# Altium schematic sheet High Side Drivers.SchDoc
size A
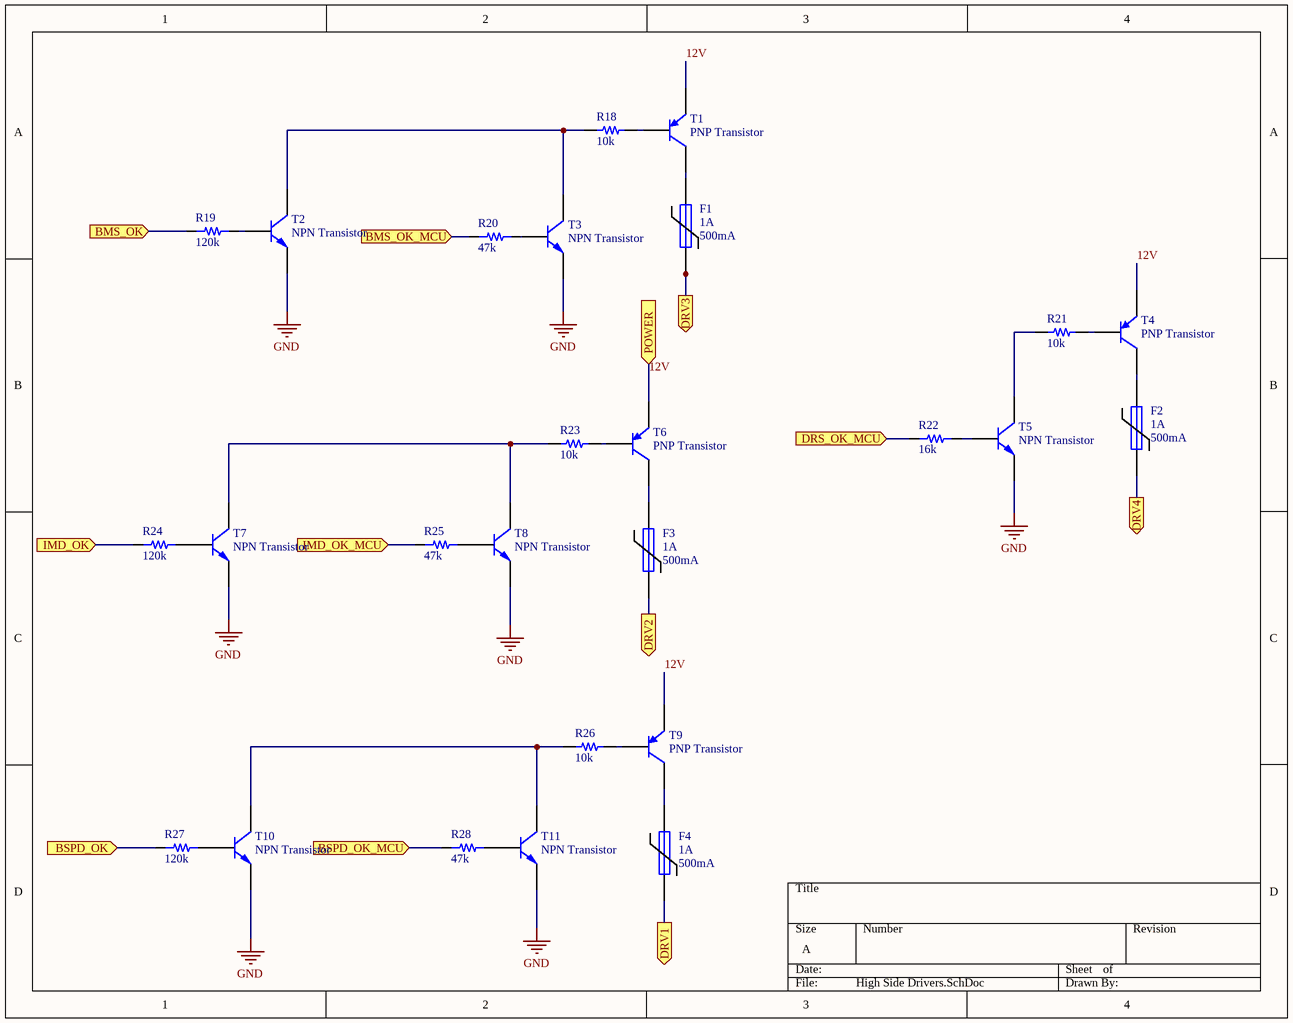
[diagram p0: High Side Drivers.SchDoc]

## Parts
F1  1A  I_hold: 500mA  [PTC Fuse 1206/3216]
F2  1A  I_hold: 500mA  [PTC Fuse 1206/3216]
F3  1A  I_hold: 500mA  [PTC Fuse 1206/3216]
F4  1A  I_hold: 500mA  [PTC Fuse 1206/3216]
R18  value 10k  [RES 0805/2012]  (hidden comment: Resistor 10k 0805 1/4W 5%)
R19  value 120k  [RES 0805/2012]  (hidden comment: Resistor 120k 0805 1/4W 1%)
R20  value 47k  [RES 0805/2012]  (hidden comment: Resistor 47k 0805 1/4W 1%)
R21  value 10k  [RES 0805/2012]  (hidden comment: Resistor 10k 0805 1/4W 5%)
R22  value 16k  [RES 0805/2012]  (hidden comment: Resistor 16k 0805 1/4W 1%)
R23  value 10k  [RES 0805/2012]  (hidden comment: Resistor 10k 0805 1/4W 5%)
R24  value 120k  [RES 0805/2012]  (hidden comment: Resistor 120k 0805 1/4W 1%)
R25  value 47k  [RES 0805/2012]  (hidden comment: Resistor 47k 0805 1/4W 1%)
R26  value 10k  [RES 0805/2012]  (hidden comment: Resistor 10k 0805 1/4W 5%)
R27  value 120k  [RES 0805/2012]  (hidden comment: Resistor 120k 0805 1/4W 1%)
R28  value 47k  [RES 0805/2012]  (hidden comment: Resistor 47k 0805 1/4W 1%)
T1  PNP Transistor  [SOT23-3]
T2  NPN Transistor  [SOT23-3]
T3  NPN Transistor  [SOT23-3]
T4  PNP Transistor  [SOT23-3]
T5  NPN Transistor  [SOT23-3]
T6  PNP Transistor  [SOT23-3]
T7  NPN Transistor  [SOT23-3]
T8  NPN Transistor  [SOT23-3]
T9  PNP Transistor  [SOT23-3]
T10  NPN Transistor  [SOT23-3]
T11  NPN Transistor  [SOT23-3]

## Ports
BMS_OK (in), BMS_OK_MCU (in), BSPD_OK (in), BSPD_OK_MCU (in), DRS_OK_MCU (in), DRV1 (out), DRV2 (out), DRV3 (out), DRV4 (out), IMD_OK (in), IMD_OK_MCU (in), POWER (in)

## Nets
GND: T2.1(E) T3.1(E) T5.1(E) T7.1(E) T8.1(E) T10.1(E) T11.1(E)
12V: T1.2(E) T4.2(E) T6.2(E) T9.2(E) ; port POWER
BMS_OK: R19.1 ; port BMS_OK
BMS_OK_MCU: R20.1 ; port BMS_OK_MCU
BSPD_OK: R27.1 ; port BSPD_OK
BSPD_OK_MCU: R28.1 ; port BSPD_OK_MCU
DRS_OK_MCU: R22.1 ; port DRS_OK_MCU
DRV1: F4.1 ; port DRV1
DRV2: F3.1 ; port DRV2
DRV3: F1.1 ; port DRV3
DRV4: F2.1 ; port DRV4
IMD_OK: R24.1 ; port IMD_OK
IMD_OK_MCU: R25.1 ; port IMD_OK_MCU
NetF1_2: F1.2 T1.3(C)
NetF2_2: F2.2 T4.3(C)
NetF3_2: F3.2 T6.3(C)
NetF4_2: F4.2 T9.3(C)
NetR18_1: R18.1 T2.3(C) T3.3(C)
NetR18_2: R18.2 T1.1(B)
NetR19_2: R19.2 T2.2(B)
NetR20_2: R20.2 T3.2(B)
NetR21_1: R21.1 T5.3(C)
NetR21_2: R21.2 T4.1(B)
NetR22_2: R22.2 T5.2(B)
NetR23_1: R23.1 T7.3(C) T8.3(C)
NetR23_2: R23.2 T6.1(B)
NetR24_2: R24.2 T7.2(B)
NetR25_2: R25.2 T8.2(B)
NetR26_1: R26.1 T10.3(C) T11.3(C)
NetR26_2: R26.2 T9.1(B)
NetR27_2: R27.2 T10.2(B)
NetR28_2: R28.2 T11.2(B)

## Library data of the parts
F1-F4 = 5: Fuse; Manufacturer_id: 1; MfrPartNo: 1206L050/15YR; idFuse: 5; Name: PTC Poly Fuse Resettable; I_max: 100A; V_max: 15V; Pd_Typ: 600mW; Created_By: Angel; Published: 8-Jun-2000; LatestRevisionDate: 17-Jul-2002; LatestRevisionNote: Re-released for DXP Platform.; PackageReference: PIN-W2/E2.8; Publisher: Altium Limited; PackageDescription: Thru-Hole; 2 Leads; Drawer_id: 1; I_trip: 1A; Link: https://www.digikey.com/product-detail/en/littelfuse-inc/1206L050-15YR/F3733CT-ND/2486168; Created_Date: 10/27/2018
R18 R21 R23 R26 = 1825: Manufacturer_id: 1; idResistor: 1825; Name: Res_10k_0805_1/4W_5%; Created_By: Nick Mah; Supplier 1: Digi-Key; Drawer_id: 1; Tolerance: 5%; Power: 1/4W; Package: 0805; ComponentLink1Description: Datasheet; Created_Date: 2018-10-20
R19 R24 R27 = 771: Manufacturer_id: 1; idResistor: 771; Name: Res_120k_0805_1/4W_1%; Created_By: Nick Mah; Supplier 1: Digi-Key; Drawer_id: 1; Tolerance: 1%; Power: 1/4W; Package: 0805; ComponentLink1Description: Datasheet; Created_Date: 2018-10-20
R20 R25 R28 = 761: Manufacturer_id: 1; idResistor: 761; Name: Res_47k_0805_1/4W_1%; Created_By: Nick Mah; Supplier 1: Digi-Key; Drawer_id: 1; Tolerance: 1%; Power: 1/4W; Package: 0805; ComponentLink1Description: Datasheet; Created_Date: 2018-10-20
R22 = 750: Manufacturer_id: 1; idResistor: 750; Name: Res_16k_0805_1/4W_1%; Created_By: Nick Mah; Supplier 1: Digi-Key; Drawer_id: 1; Tolerance: 1%; Power: 1/4W; Package: 0805; ComponentLink1Description: Datasheet; Created_Date: 2018-10-20
T1 T4 T6 T9 = 3: Manufacturer_id: 1; idBJT: 3; Name: MMBT4403WT1G; Ic: 600mA; Vce(Max): -40V; Created_By: Angel; Drawer_id: 1; Type: PNP; Num_Circuits: 1; Package: SOT23-3; MfrPartNo: MMBT4403WT1G; Link: https://www.digikey.com/product-detail/en/on-semiconductor/MMBT4403WT1G/MMBT4403WT1GOSCT-ND/3487572
T2 T3 T5 T7 T8 T10 T11 = 2: Manufacturer_id: 1; idBJT: 2; Name: MMBT4401; Drawer_id: 1; Type: NPN